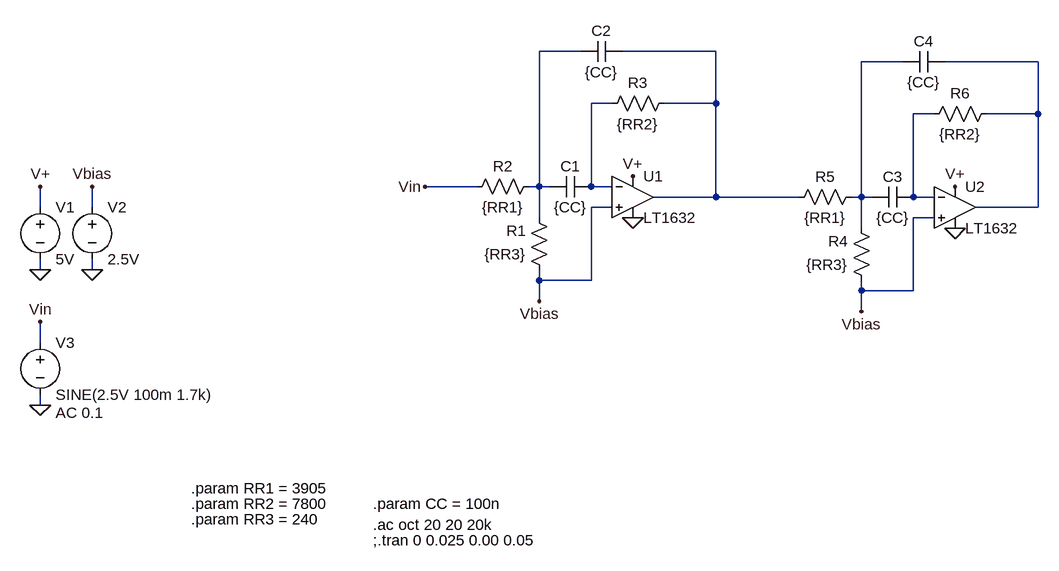
[diagram p0: schematic MFT.asc]
MFT.asc, the LTspice schematic file:
Version 4
SHEET 1 1832 680
WIRE 384 -288 320 -288
WIRE 592 -288 448 -288
WIRE 880 -272 816 -272
WIRE 1088 -272 944 -272
WIRE 432 -208 400 -208
WIRE 592 -208 592 -288
WIRE 592 -208 512 -208
WIRE 928 -192 896 -192
WIRE 1088 -192 1088 -272
WIRE 1088 -192 1008 -192
WIRE 224 -80 144 -80
WIRE 320 -80 320 -288
WIRE 320 -80 304 -80
WIRE 336 -80 320 -80
WIRE 400 -80 400 -208
WIRE 432 -80 400 -80
WIRE 592 -64 592 -208
WIRE 592 -64 496 -64
WIRE 720 -64 592 -64
WIRE 816 -64 816 -272
WIRE 816 -64 800 -64
WIRE 832 -64 816 -64
WIRE 896 -64 896 -192
WIRE 928 -64 896 -64
WIRE -448 -48 -448 -80
WIRE -368 -48 -368 -80
WIRE 432 -48 400 -48
WIRE 1088 -48 1088 -192
WIRE 1088 -48 992 -48
WIRE 320 -32 320 -80
WIRE 928 -32 896 -32
WIRE 816 -16 816 -64
WIRE -448 48 -448 32
WIRE -368 48 -368 32
WIRE 320 64 320 48
WIRE 400 64 400 -48
WIRE 400 64 320 64
WIRE 816 80 816 64
WIRE 896 80 896 -32
WIRE 896 80 816 80
WIRE 320 96 320 64
WIRE 816 112 816 80
WIRE -448 160 -448 128
WIRE -448 256 -448 240
FLAG -368 48 0
FLAG -448 48 0
FLAG -448 256 0
FLAG -368 -80 Vbias
FLAG -448 -80 V+
FLAG -448 128 Vin
FLAG 464 -32 0
FLAG 464 -96 V+
FLAG 320 96 Vbias
FLAG 144 -80 Vin
FLAG 960 -16 0
FLAG 960 -80 V+
FLAG 816 112 Vbias
SYMBOL voltage -448 -64 R0
WINDOW 123 0 0 Left 0
WINDOW 39 0 0 Left 0
SYMATTR InstName V1
SYMATTR Value 5V
SYMBOL voltage -368 -64 R0
WINDOW 123 0 0 Left 0
WINDOW 39 0 0 Left 0
SYMATTR InstName V2
SYMATTR Value 2.5V
SYMBOL voltage -448 144 R0
WINDOW 123 24 124 Left 2
WINDOW 39 0 0 Left 0
SYMATTR Value2 AC 0.1
SYMATTR InstName V3
SYMATTR Value SINE(2.5V 100m 1.7k)
SYMBOL Opamps\\LT1632 464 -128 R0
SYMATTR InstName U1
SYMBOL res 336 64 R180
WINDOW 0 36 76 Left 2
WINDOW 3 36 40 Left 2
SYMATTR InstName R1
SYMATTR Value {RR3}
SYMBOL res 320 -96 R90
WINDOW 0 0 56 VBottom 2
WINDOW 3 32 56 VTop 2
SYMATTR InstName R2
SYMATTR Value {RR1}
SYMBOL cap 400 -96 R90
WINDOW 0 0 32 VBottom 2
WINDOW 3 32 32 VTop 2
SYMATTR InstName C1
SYMATTR Value {CC}
SYMBOL res 528 -224 R90
WINDOW 0 0 56 VBottom 2
WINDOW 3 32 56 VTop 2
SYMATTR InstName R3
SYMATTR Value {RR2}
SYMBOL cap 448 -304 R90
WINDOW 0 0 32 VBottom 2
WINDOW 3 32 32 VTop 2
SYMATTR InstName C2
SYMATTR Value {CC}
SYMBOL Opamps\\LT1632 960 -112 R0
SYMATTR InstName U2
SYMBOL res 832 80 R180
WINDOW 0 36 76 Left 2
WINDOW 3 36 40 Left 2
SYMATTR InstName R4
SYMATTR Value {RR3}
SYMBOL res 816 -80 R90
WINDOW 0 0 56 VBottom 2
WINDOW 3 32 56 VTop 2
SYMATTR InstName R5
SYMATTR Value {RR1}
SYMBOL cap 896 -80 R90
WINDOW 0 0 32 VBottom 2
WINDOW 3 32 32 VTop 2
SYMATTR InstName C3
SYMATTR Value {CC}
SYMBOL res 1024 -208 R90
WINDOW 0 0 56 VBottom 2
WINDOW 3 32 56 VTop 2
SYMATTR InstName R6
SYMATTR Value {RR2}
SYMBOL cap 944 -288 R90
WINDOW 0 0 32 VBottom 2
WINDOW 3 32 32 VTop 2
SYMATTR InstName C4
SYMATTR Value {CC}
TEXT -216 384 Left 2 !.param RR1 = 3905
TEXT -216 408 Left 2 !.param RR2 = 7800
TEXT 64 408 Left 2 !.param CC = 100n
TEXT 64 440 Left 2 !.ac oct 20 20 20k
TEXT 64 464 Left 2 !;.tran 0 0.025 0.00 0.05
TEXT -216 432 Left 2 !.param RR3 = 240

The netlist it stands for:
* MFT.asc
V1 V+ 0 5V
V2 Vbias 0 2.5V
V3 Vin 0 SINE(2.5V 100m 1.7k) AC 0.1
XU1 Vbias N005 V+ 0 N002 LT1632  ; pins In+ In- V+ V- OUT
R1 Vbias N001 {RR3}
R2 N001 Vin {RR1}
C1 N005 N001 {CC}
R3 N002 N005 {RR2}
C2 N002 N001 {CC}
XU2 Vbias N006 V+ 0 N004 LT1632  ; pins In+ In- V+ V- OUT
R4 Vbias N003 {RR3}
R5 N003 N002 {RR1}
C3 N006 N003 {CC}
R6 N004 N006 {RR2}
C4 N004 N003 {CC}
.param RR1 = 3905
.param RR2 = 7800
.param CC = 100n
.ac oct 20 20 20k
;.tran 0 0.025 0.00 0.05
.param RR3 = 240
.lib LTC.lib
.backanno
.end